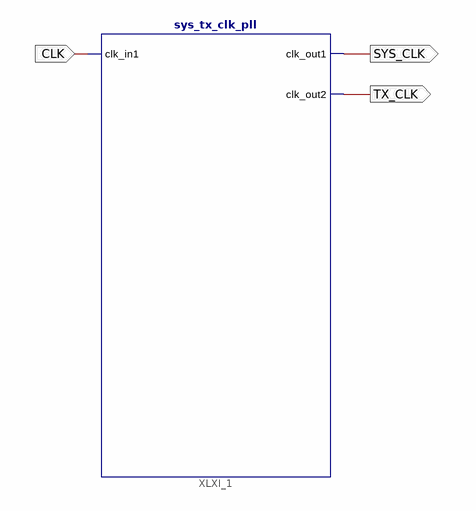
[diagram p0: schematic sheet 1]
// Xilinx ISE schematic pll_wrapper.sch (spartan6) as structural Verilog: 1 symbols, 3 ports
module pll_wrapper (
  input  CLK,
  output SYS_CLK,
  output TX_CLK
);

  sys_tx_clk_pll XLXI_1 (.clk_in1(CLK), .clk_out1(SYS_CLK), .clk_out2(TX_CLK));
endmodule
